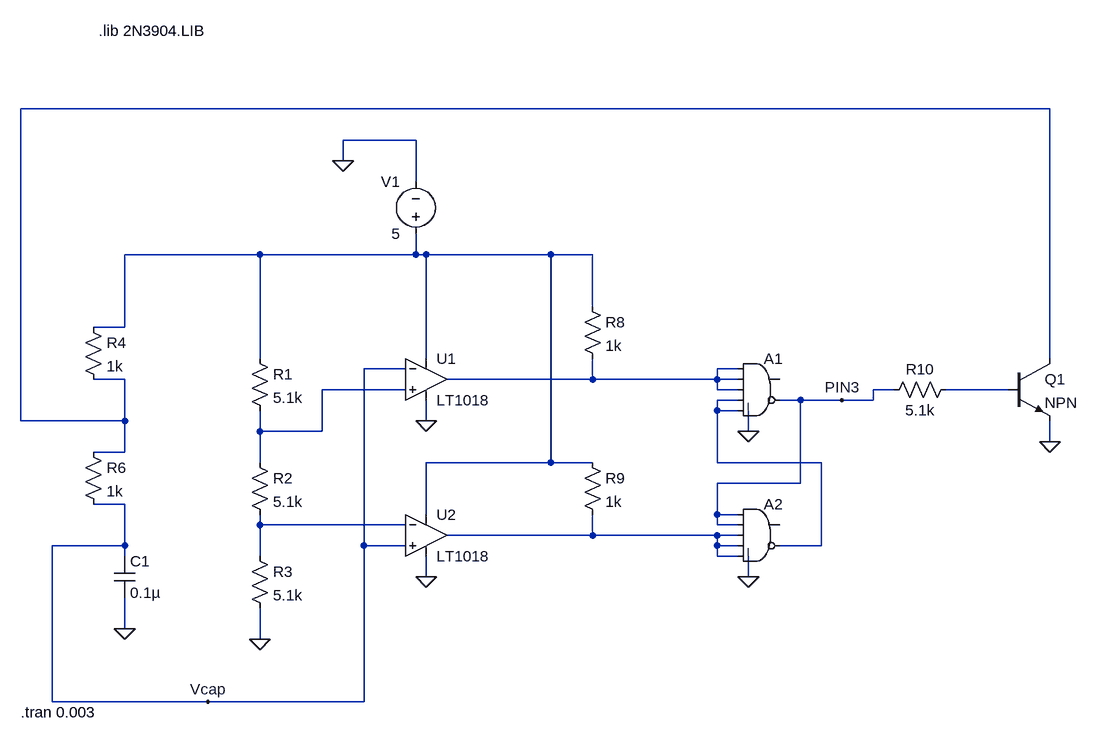
[diagram p0: schematic 555 Timer Sim.asc]
555 Timer Sim.asc, the LTspice schematic file:
Version 4
SHEET 1 1428 680
WIRE 1344 -288 -240 -288
WIRE 368 -240 256 -240
WIRE 256 -208 256 -240
WIRE 368 -176 368 -240
WIRE 128 -64 -80 -64
WIRE 368 -64 368 -96
WIRE 368 -64 128 -64
WIRE 384 -64 368 -64
WIRE 576 -64 384 -64
WIRE 640 -64 576 -64
WIRE 640 16 640 -64
WIRE -80 48 -80 -64
WIRE -80 48 -128 48
WIRE 128 96 128 -64
WIRE 384 96 384 -64
WIRE 1344 96 1344 -288
WIRE 352 112 288 112
WIRE 864 112 832 112
WIRE -80 128 -128 128
WIRE 640 128 640 96
WIRE 640 128 416 128
WIRE 832 128 832 112
WIRE 832 128 640 128
WIRE 864 128 832 128
WIRE 352 144 224 144
WIRE 832 144 832 128
WIRE 864 144 832 144
WIRE 1104 144 1072 144
WIRE 1280 144 1184 144
WIRE 864 160 832 160
WIRE 960 160 928 160
WIRE 1024 160 960 160
WIRE 1072 160 1072 144
WIRE 1072 160 1024 160
WIRE 832 176 832 160
WIRE 864 176 832 176
WIRE -240 192 -240 -288
WIRE -80 192 -80 128
WIRE -80 192 -240 192
WIRE 384 192 384 160
WIRE 128 208 128 176
WIRE 224 208 224 144
WIRE 224 208 128 208
WIRE 880 208 880 176
WIRE 1344 224 1344 192
WIRE -80 240 -80 192
WIRE -80 240 -128 240
WIRE 128 256 128 208
WIRE 576 256 576 -64
WIRE 576 256 384 256
WIRE 640 256 576 256
WIRE 832 256 832 176
WIRE 992 256 832 256
WIRE 960 288 960 160
WIRE 960 288 832 288
WIRE -80 320 -128 320
WIRE 384 336 384 256
WIRE 832 336 832 288
WIRE 864 336 832 336
WIRE 128 352 128 336
WIRE 352 352 128 352
WIRE 832 352 832 336
WIRE 864 352 832 352
WIRE 640 368 640 336
WIRE 640 368 416 368
WIRE 832 368 640 368
WIRE 864 368 832 368
WIRE -80 384 -80 320
WIRE -80 384 -192 384
WIRE 288 384 288 112
WIRE 352 384 288 384
WIRE 832 384 832 368
WIRE 864 384 832 384
WIRE 992 384 992 256
WIRE 992 384 928 384
WIRE -80 400 -80 384
WIRE 128 400 128 352
WIRE 832 400 832 384
WIRE 864 400 832 400
WIRE 384 432 384 400
WIRE 880 432 880 400
WIRE -80 512 -80 464
WIRE 128 528 128 480
WIRE -192 624 -192 384
WIRE 48 624 -192 624
WIRE 288 624 288 384
WIRE 288 624 48 624
FLAG 256 -208 0
FLAG -80 512 0
FLAG 128 528 0
FLAG 384 192 0
FLAG 384 432 0
FLAG 880 208 0
FLAG 880 432 0
FLAG 1344 224 0
FLAG 48 624 Vcap
FLAG 1024 160 PIN3
SYMBOL res 112 80 R0
SYMATTR InstName R1
SYMATTR Value 5.1k
SYMBOL res 112 240 R0
SYMATTR InstName R2
SYMATTR Value 5.1k
SYMBOL res 112 384 R0
SYMATTR InstName R3
SYMATTR Value 5.1k
SYMBOL voltage 368 -80 R180
WINDOW 0 24 96 Left 2
WINDOW 3 24 16 Left 2
WINDOW 123 0 0 Left 0
WINDOW 39 0 0 Left 0
SYMATTR InstName V1
SYMATTR Value 5
SYMBOL res -144 32 R0
SYMATTR InstName R4
SYMATTR Value 1k
SYMBOL res -144 224 R0
SYMATTR InstName R6
SYMATTR Value 1k
SYMBOL cap -96 400 R0
SYMATTR InstName C1
SYMATTR Value 0.1µ
SYMBOL res 624 0 R0
SYMATTR InstName R8
SYMATTR Value 1k
SYMBOL res 624 240 R0
SYMATTR InstName R9
SYMATTR Value 1k
SYMBOL res 1200 128 R90
WINDOW 0 0 56 VBottom 2
WINDOW 3 32 56 VTop 2
SYMATTR InstName R10
SYMATTR Value 5.1k
SYMBOL Comparators\\LT1018 384 128 R0
SYMATTR InstName U1
SYMBOL Comparators\\LT1018 384 368 R0
SYMATTR InstName U2
SYMBOL Digital\\and 896 80 R0
SYMATTR InstName A1
SYMBOL Digital\\and 896 304 R0
SYMATTR InstName A2
SYMBOL npn 1280 96 R0
SYMATTR InstName Q1
TEXT -240 640 Left 2 !.tran 0.003
TEXT -120 -408 Left 2 !.lib 2N3904.LIB

The netlist it stands for:
* 555 Timer Sim.asc
R1 N002 N004 5.1k
R2 N004 N007 5.1k
R3 N007 0 5.1k
V1 N002 0 5
R4 N002 N001 1k
R6 N001 Vcap 1k
C1 Vcap 0 0.1µ
R8 N002 N003 1k
R9 N002 N008 1k
R10 N005 PIN3 5.1k
XU1 N004 Vcap N002 0 N003 LT1018  ; pins In+ In- V+ V- OUT
XU2 Vcap N007 N002 0 N008 LT1018  ; pins In+ In- V+ V- OUT
A1 N003 N003 N003 N006 N006 PIN3 0 0 AND
A2 PIN3 PIN3 N008 N008 N008 N006 0 0 AND
Q1 N001 N005 0 0 NPN
.model NPN NPN
.model PNP PNP
.lib standard.bjt
.tran 0.003
.lib 2N3904.LIB
.lib LTC1.lib
.backanno
.end